# Altium schematic sheet HVP_ADC_CONNECTIONS.SchDoc
size A
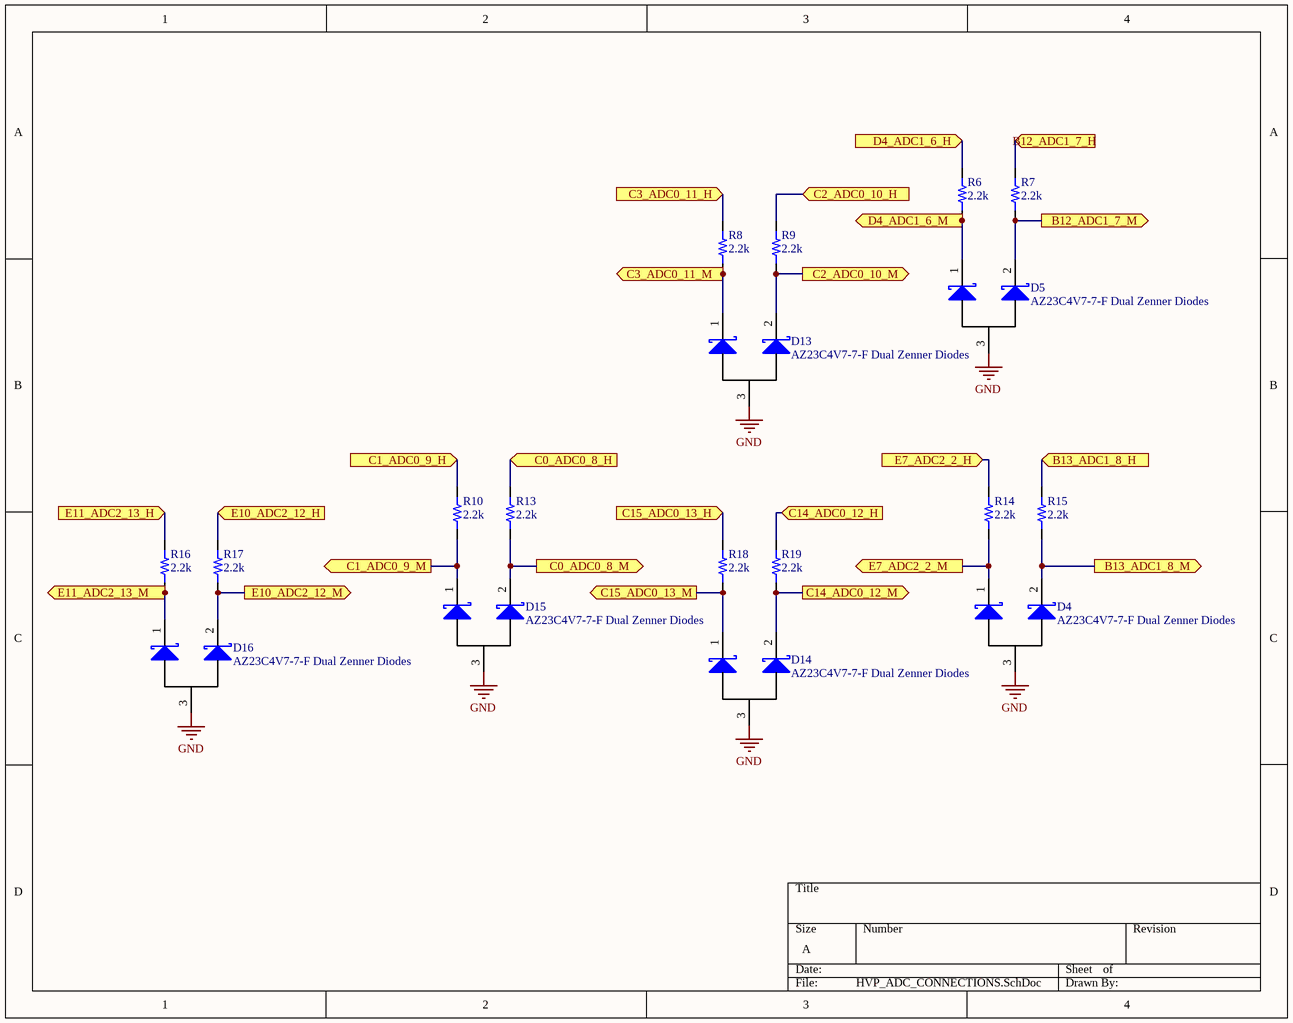
[diagram p0: HVP_ADC_CONNECTIONS.SchDoc]

## Parts
D4  AZ23C4V7-7-F Dual Zenner Diodes  [SOT23-3]
D5  AZ23C4V7-7-F Dual Zenner Diodes  [SOT23-3]
D13  AZ23C4V7-7-F Dual Zenner Diodes  [SOT23-3]
D14  AZ23C4V7-7-F Dual Zenner Diodes  [SOT23-3]
D15  AZ23C4V7-7-F Dual Zenner Diodes  [SOT23-3]
D16  AZ23C4V7-7-F Dual Zenner Diodes  [SOT23-3]
R6  value 2.2k  [RES 0402/1005]  (hidden comment: Resistor 2.2k 0402 1/10W 1%)
R7  value 2.2k  [RES 0402/1005]  (hidden comment: Resistor 2.2k 0402 1/10W 1%)
R8  value 2.2k  [RES 0402/1005]  (hidden comment: Resistor 2.2k 0402 1/10W 1%)
R9  value 2.2k  [RES 0402/1005]  (hidden comment: Resistor 2.2k 0402 1/10W 1%)
R10  value 2.2k  [RES 0402/1005]  (hidden comment: Resistor 2.2k 0402 1/10W 1%)
R13  value 2.2k  [RES 0402/1005]  (hidden comment: Resistor 2.2k 0402 1/10W 1%)
R14  value 2.2k  [RES 0402/1005]  (hidden comment: Resistor 2.2k 0402 1/10W 1%)
R15  value 2.2k  [RES 0402/1005]  (hidden comment: Resistor 2.2k 0402 1/10W 1%)
R16  value 2.2k  [RES 0402/1005]  (hidden comment: Resistor 2.2k 0402 1/10W 1%)
R17  value 2.2k  [RES 0402/1005]  (hidden comment: Resistor 2.2k 0402 1/10W 1%)
R18  value 2.2k  [RES 0402/1005]  (hidden comment: Resistor 2.2k 0402 1/10W 1%)
R19  value 2.2k  [RES 0402/1005]  (hidden comment: Resistor 2.2k 0402 1/10W 1%)

## Ports
B12_ADC1_7_H (in), B12_ADC1_7_M (out), B13_ADC1_8_H (in), B13_ADC1_8_M (out), C0_ADC0_8_H (in), C0_ADC0_8_M (out), C1_ADC0_9_H (in), C1_ADC0_9_M (out), C2_ADC0_10_H (in), C2_ADC0_10_M (out), C3_ADC0_11_H (in), C3_ADC0_11_M (out), C14_ADC0_12_H (in), C14_ADC0_12_M (out), C15_ADC0_13_H (in), C15_ADC0_13_M (out), D4_ADC1_6_H (in), D4_ADC1_6_M (out), E7_ADC2_2_H (in), E7_ADC2_2_M (out), E10_ADC2_12_H (in), E10_ADC2_12_M (out), E11_ADC2_13_H (in), E11_ADC2_13_M (out)

## Nets
GND: D4.3 D5.3 D13.3 D14.3 D15.3 D16.3
B12_ADC1_7_H: R7.2 ; port B12_ADC1_7_H
B12_ADC1_7_M: D5.2 R7.1 ; port B12_ADC1_7_M
B13_ADC1_8_H: R15.2 ; port B13_ADC1_8_H
B13_ADC1_8_M: D4.2 R15.1 ; port B13_ADC1_8_M
C0_ADC0_8_H: R13.2 ; port C0_ADC0_8_H
C0_ADC0_8_M: D15.2 R13.1 ; port C0_ADC0_8_M
C1_ADC0_9_H: R10.2 ; port C1_ADC0_9_H
C1_ADC0_9_M: D15.1 R10.1 ; port C1_ADC0_9_M
C2_ADC0_10_H: R9.2 ; port C2_ADC0_10_H
C2_ADC0_10_M: D13.2 R9.1 ; port C2_ADC0_10_M
C3_ADC0_11_H: R8.2 ; port C3_ADC0_11_H
C3_ADC0_11_M: D13.1 R8.1 ; port C3_ADC0_11_M
C14_ADC0_12_H: R19.2 ; port C14_ADC0_12_H
C14_ADC0_12_M: D14.2 R19.1 ; port C14_ADC0_12_M
C15_ADC0_13_H: R18.2 ; port C15_ADC0_13_H
C15_ADC0_13_M: D14.1 R18.1 ; port C15_ADC0_13_M
D4_ADC1_6_H: R6.2 ; port D4_ADC1_6_H
D4_ADC1_6_M: D5.1 R6.1 ; port D4_ADC1_6_M
E7_ADC2_2_H: R14.2 ; port E7_ADC2_2_H
E7_ADC2_2_M: D4.1 R14.1 ; port E7_ADC2_2_M
E10_ADC2_12_H: R17.2 ; port E10_ADC2_12_H
E10_ADC2_12_M: D16.2 R17.1 ; port E10_ADC2_12_M
E11_ADC2_13_H: R16.2 ; port E11_ADC2_13_H
E11_ADC2_13_M: D16.1 R16.1 ; port E11_ADC2_13_M

## Library data of the parts
D4 D5 D13-D16 = 14: DIODE ZENER ARRAY 4.7V SOT23-3; Manufacturer_id: 1; idDiode: 14; Num_Circuits: 2; Power: 300mW; Created_By: Angel Delgado; Drawer_id: 1; Name: AZ23C4V7-7-F; Value: 4.7V; Type: Zener Array; Package: SOT23-3; MfrPartNo: AZ23C4V7-7-F; Link: https://www.digikey.com/product-detail/en/diodes-incorporated/AZ23C4V7-7-F/AZ23C4V7-FDICT-ND/815309; Supplier1: Digi-Key
R6-R10 R13-R19 = 81: Manufacturer_id: 1; idResistor: 81; Name: Res_2.2k_0402_1/10W_1%; Created_By: Nick Mah; Supplier 1: Digi-Key; Drawer_id: 1; Tolerance: 1%; Power: 1/10W; Package: 0402; ComponentLink1Description: Datasheet; Created_Date: 2018-10-20